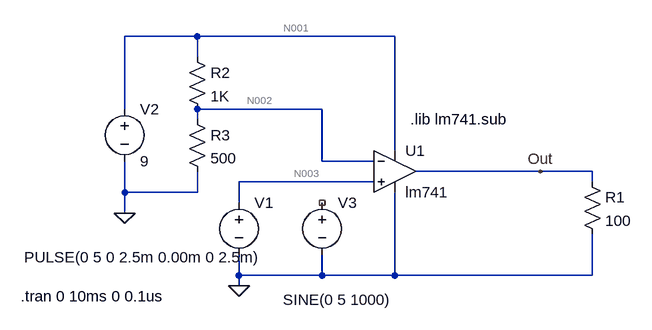
[diagram p0: schematic Draft2.asc]
Draft2.asc, the LTspice schematic file:
Version 4
SHEET 1 1088 680
WIRE -144 -80 -256 -80
WIRE 160 -80 -144 -80
WIRE -144 -48 -144 -80
WIRE -256 32 -256 -80
WIRE 48 32 -144 32
WIRE -144 48 -144 32
WIRE 160 96 160 -80
WIRE 48 112 48 32
WIRE 128 112 48 112
WIRE 384 128 192 128
WIRE 464 128 384 128
WIRE 128 144 -80 144
WIRE 464 144 464 128
WIRE -256 160 -256 112
WIRE -144 160 -144 128
WIRE -144 160 -256 160
WIRE -80 176 -80 144
WIRE -256 192 -256 160
WIRE -80 288 -80 256
WIRE 48 288 48 256
WIRE 48 288 -80 288
WIRE 160 288 160 160
WIRE 160 288 48 288
WIRE 464 288 464 224
WIRE 464 288 160 288
WIRE -80 304 -80 288
WIRE -80 304 -96 304
FLAG -80 304 0
FLAG -256 192 0
FLAG 384 128 Out
SYMBOL voltage -80 160 R0
WINDOW 123 0 0 Left 2
WINDOW 39 0 0 Left 2
WINDOW 3 -331 100 Left 2
SYMATTR Value PULSE(0 5 0 2.5m 0.00m 0 2.5m)
SYMATTR InstName V1
SYMBOL res 448 128 R0
SYMATTR InstName R1
SYMATTR Value 100
SYMBOL voltage -256 16 R0
WINDOW 123 0 0 Left 2
WINDOW 39 0 0 Left 2
SYMATTR InstName V2
SYMATTR Value 9
SYMBOL res -160 -64 R0
SYMATTR InstName R2
SYMATTR Value 1K
SYMBOL res -160 32 R0
SYMATTR InstName R3
SYMATTR Value 500
SYMBOL Opamps\\opamp2 160 64 R0
SYMATTR InstName U1
SYMATTR Value lm741
SYMBOL voltage 48 160 R0
WINDOW 3 -60 165 Left 2
WINDOW 123 0 0 Left 2
WINDOW 39 0 0 Left 2
SYMATTR Value SINE(0 5 1000)
SYMATTR InstName V3
TEXT -416 320 Left 2 !.tran 0 10ms 0 0.1us
TEXT 184 48 Left 2 !.lib lm741.sub

The netlist it stands for:
* Draft2.asc
V1 N003 0 PULSE(0 5 0 2.5m 0.00m 0 2.5m)
R1 Out 0 100
V2 N001 0 9
R2 N001 N002 1K
R3 N002 0 500
XU1 N003 N002 N001 0 Out lm741  ; pins In+ In- V+ V- OUT
V3 NC_01 0 SINE(0 5 1000)
.tran 0 10ms 0 0.1us
.lib lm741.sub
.backanno
.end

* Results of the author's LTspice run, read from the files saved beside the schematic
* Operating Point, zero values left out:
*   V(out) = 686.6 mV
*   V(n001) = 9 V
*   V(n002) = 2.998 V
*   I(R3) = 5.996 mA
*   I(R2) = 6.002 mA
*   I(R1) = 6.866 mA
*   I(V2) = -14.12 mA
*   I(V1) = 6.016 µA
*   Ix(u1:1) = -6.016 µA
*   Ix(u1:2) = 6.176 µA
*   Ix(u1:99) = 8.12 mA
*   Ix(u1:50) = -1.254 mA
*   Ix(u1:28) = -6.866 mA
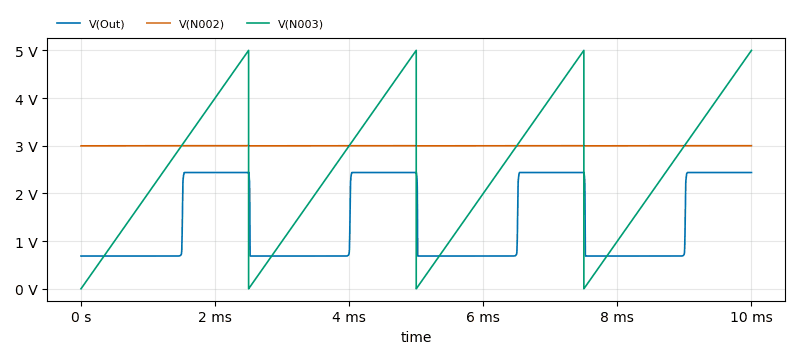
[diagram p1: Transient Analysis of Draft2.asc, plotted from the saved traces]
* Transient Analysis, 1 run:
*   V(Out): min 686.5 mV, max 2.443 V, average 1.388 V, rms 1.63 V, last 2.438 V
*   V(N002): min 2.998 V, max 3.001 V, average 3 V, rms 3 V, last 3.001 V
*   V(N003): min 0 V, max 5 V, average 2.5 V, rms 2.887 V, last 5 V